# EAGLE design Prototipo v1 (EAGLE 9.7.0)
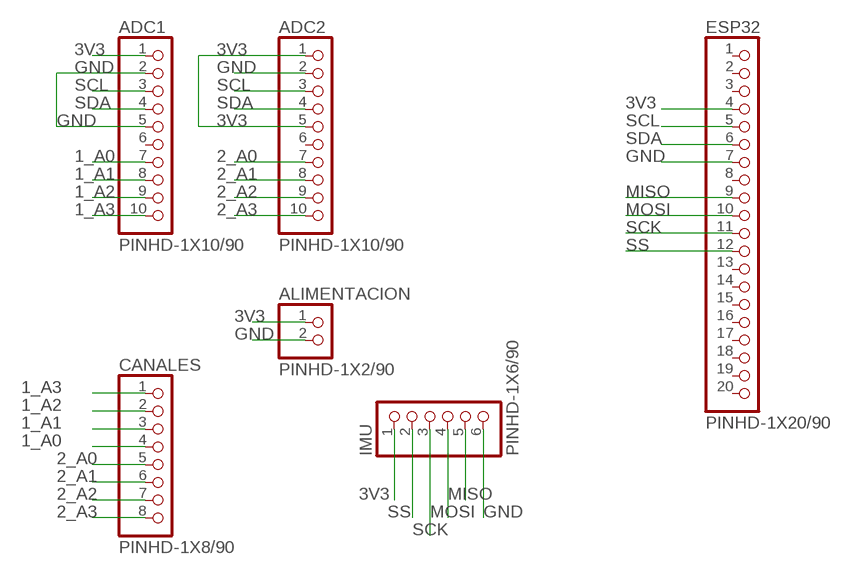
[diagram p0: schematic, sheet 1]

## Parts
ADC1  PINHD-1X10/90  [1X10/90]
ADC2  PINHD-1X10/90  [1X10/90]
ALIMENTACION  PINHD-1X2/90  [1X02/90]
CANALES  PINHD-1X8/90  [1X08/90]
ESP32  PINHD-1X20/90  [1X20/90]
IMU  PINHD-1X6/90  [1X06/90]

## Nets
1_A0: ADC1.7 CANALES.4
1_A1: ADC1.8 CANALES.3
1_A2: ADC1.9 CANALES.2
1_A3: ADC1.10 CANALES.1
2_A0: ADC2.7 CANALES.5
2_A1: ADC2.8 CANALES.6
2_A2: ADC2.9 CANALES.7
2_A3: ADC2.10 CANALES.8
3V3: ADC1.1 ADC2.1 ADC2.5 ALIMENTACION.1 ESP32.4 IMU.1
GND: ADC1.2 ADC1.5 ADC2.2 ALIMENTACION.2 ESP32.7 IMU.6
MISO: ESP32.9 IMU.5
MOSI: ESP32.10 IMU.4
SCK: ESP32.11 IMU.3
SCL: ADC1.3 ADC2.3 ESP32.5
SDA: ADC1.4 ADC2.4 ESP32.6
SS: ESP32.12 IMU.2
Unconnected: ADC1.6 ADC2.6 ESP32.1 ESP32.2 ESP32.3 ESP32.8 ESP32.13 ESP32.14 ESP32.15 ESP32.16 ESP32.17 ESP32.18 ESP32.19 ESP32.20

## Library data of the parts
ADC1 ADC2 = Connector:PINHD-1X10: PIN HEADER; CATEGORY: Headers; DESCRIPTION: Header, Right Angle, 10 Position; MANUFACTURER: Generic; MPN: Generic; OPERATING_TEMPERATURE: Generic; PART_STATUS: Active; PITCH: 0.100" (2.54mm); ROHS_COMPLIANCE: Generic; SERIES: Generic; SUB-CATEGORY: Headers, Male Pins; TYPE: Board to Board or Cable, Unshrouded, Through Hole, Right Angle
ALIMENTACION = Connector:PINHD-1X2: PIN HEADER; CATEGORY: Headers; DESCRIPTION: Header, Right Angle, 2 Position; MANUFACTURER: Generic; MPN: Generic; OPERATING_TEMPERATURE: Generic; PART_STATUS: Active; PITCH: 0.100" (2.54mm); ROHS_COMPLIANCE: Generic; SERIES: Generic; SUB-CATEGORY: Headers, Male Pins; TYPE: Board to Board or Cable, Unshrouded, Through Hole, Right Angle
CANALES = Connector:PINHD-1X8: PIN HEADER; CATEGORY: Headers; DESCRIPTION: Header, Right Angle, 8 Position; MANUFACTURER: Generic; MPN: Generic; OPERATING_TEMPERATURE: Generic; PART_STATUS: Active; PITCH: 0.100" (2.54mm); ROHS_COMPLIANCE: Generic; SERIES: Generic; SUB-CATEGORY: Headers, Male Pins; TYPE: Board to Board or Cable, Unshrouded, Through Hole, Right Angle
ESP32 = Connector:PINHD-1X20: PIN HEADER; CATEGORY: Headers; DESCRIPTION: Header, Right Angle, 20 Position; MANUFACTURER: Generic; MPN: Generic; OPERATING_TEMPERATURE: Generic; PART_STATUS: Active; PITCH: 0.100" (2.54mm); ROHS_COMPLIANCE: Generic; SERIES: Generic; SUB-CATEGORY: Headers, Male Pins; TYPE: Board to Board or Cable, Unshrouded, Through Hole, Right Angle
IMU = Connector:PINHD-1X6: PIN HEADER; CATEGORY: Headers; DESCRIPTION: Header, Right Angle, 6 Position; MANUFACTURER: Generic; MPN: Generic; OPERATING_TEMPERATURE: Generic; PART_STATUS: Active; PITCH: 0.100" (2.54mm); ROHS_COMPLIANCE: Generic; SERIES: Generic; SUB-CATEGORY: Headers, Male Pins; TYPE: Board to Board or Cable, Unshrouded, Through Hole, Right Angle

## Board
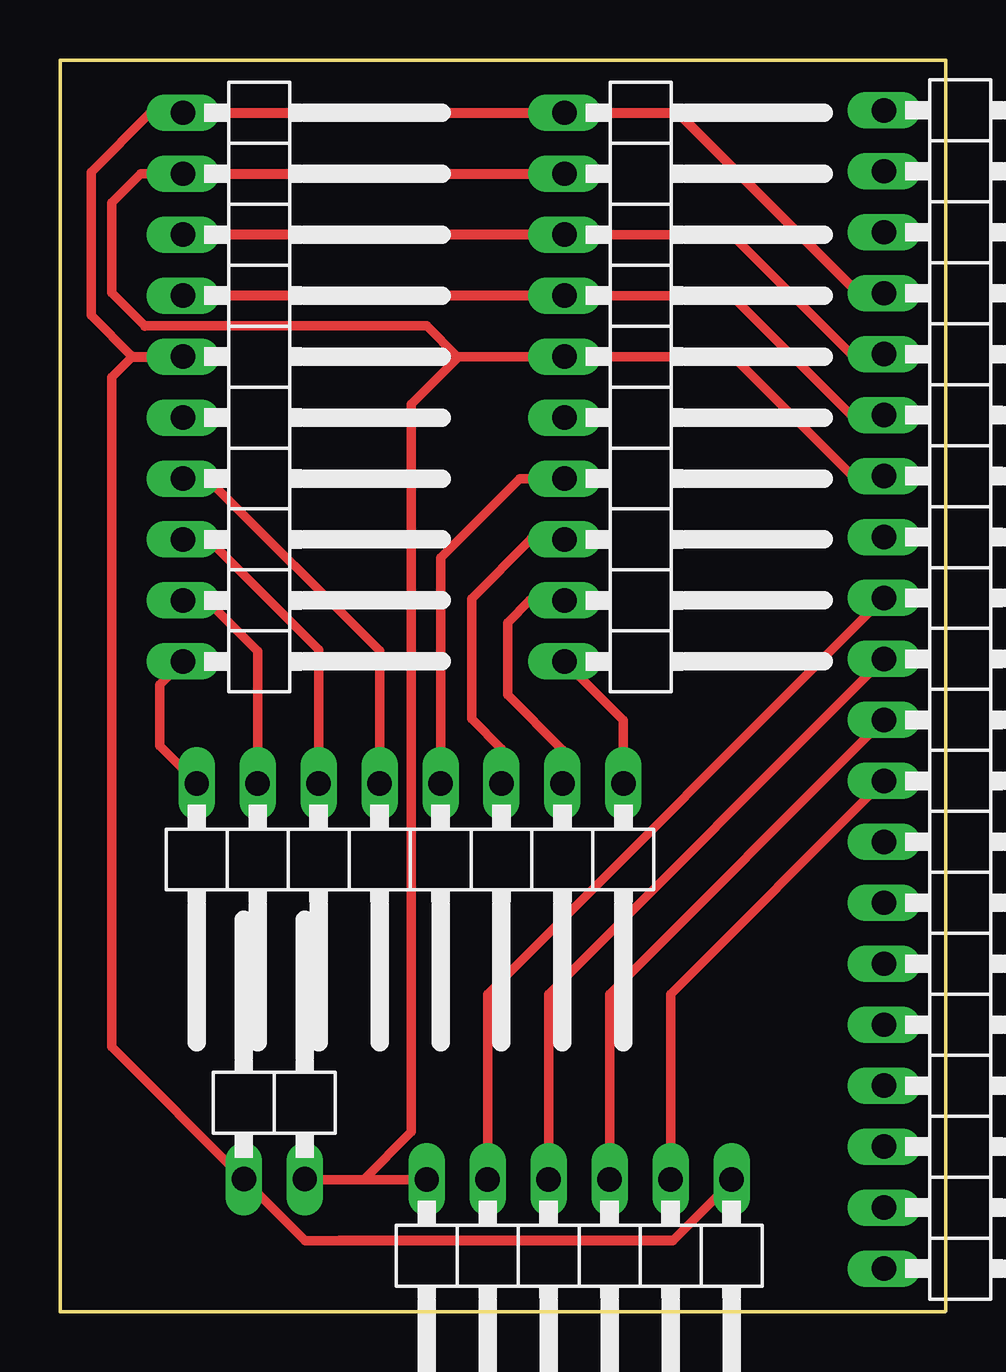
[diagram p1: board, top side]

Size 36.9 x 52.16 mm. Coordinates in mm from the lower left corner, seen from the top.
Outline: 0,52.16 0,0 36.88,0 36.9,0.02 36.9,52.16 0,52.16
Copper layers (1*16): Top / Bottom
Stack-up Default Layer Stack: Top User Defined 0.035mm / Dielectric-1 User Defined 1.5mm / Bottom User Defined 0.035mm
Design rules: minimum copper width 6mil, minimum drill size 0.35mm, copper clearance wire_polygon to wire_polygon 6mil, copper clearance wire_polygon to pad_smd 6mil, copper clearance wire_polygon to via 6mil, copper clearance pad_smd to pad_smd 6mil, copper clearance pad_smd to via 6mil, copper clearance via to via 6mil, copper clearance smd to pad (same net) 6mil, copper clearance smd to via (same net) 6mil, copper clearance smd to smd (same net) 6mil, dimension clearance 40mil, via restrict clearance 0mil, restrict clearance 0mil, drill distance 6mil, keepout clearance 0mil

### Footprints (pad centres in the part's own frame; a part is rotated, then mirrored left to right if it is on the bottom)
1X10/90 = drill 1.016 long: 1 -11.43,-3.81; 2 -8.89,-3.81; 3 -6.35,-3.81; 4 -3.81,-3.81; 5 -1.27,-3.81; 6 1.27,-3.81; 7 3.81,-3.81; 8 6.35,-3.81; 9 8.89,-3.81; 10 11.43,-3.81
1X02/90 = drill 1.016 long: 1 -1.27,-3.81; 2 1.27,-3.81
1X08/90 = drill 1.016 long: 1 -8.89,-3.81; 2 -6.35,-3.81; 3 -3.81,-3.81; 4 -1.27,-3.81; 5 1.27,-3.81; 6 3.81,-3.81; 7 6.35,-3.81; 8 8.89,-3.81
1X20/90 = drill 1.016 long: 1 -24.13,-3.81; 2 -21.59,-3.81; 3 -19.05,-3.81; 4 -16.51,-3.81; 5 -13.97,-3.81; 6 -11.43,-3.81; 7 -8.89,-3.81; 8 -6.35,-3.81; 9 -3.81,-3.81; 10 -1.27,-3.81; 11 1.27,-3.81; 12 3.81,-3.81; 13 6.35,-3.81; 14 8.89,-3.81; 15 11.43,-3.81; 16 13.97,-3.81; 17 16.51,-3.81; 18 19.05,-3.81; 19 21.59,-3.81; 20 24.13,-3.81
1X06/90 = drill 1.016 long: 1 -6.35,-3.81; 2 -3.81,-3.81; 3 -1.27,-3.81; 4 1.27,-3.81; 5 3.81,-3.81; 6 6.35,-3.81

### Placement (x,y rotation side)
ADC1  24.83,38.53 270 top
ADC2  8.93,38.53 270 top
ALIMENTACION  8.93,9.34 0 top
CANALES  14.59,18.21 180 top
ESP32  38.14,25.93 270 top
IMU  21.63,1.7 180 top

### Tracks (layer width: path | path; a pad name or v marks a point on that pad's centre or on a via)
1_A0
  Top 0.4: CANALES.4 15.86,31.42 19.16,34.72 ADC1.7
1_A1
  Top 0.4: CANALES.3 18.4,23.46 17.15,24.71 17.15,29.71 19.62,32.18 ADC1.8
1_A2
  Top 0.4: CANALES.2 20.94,23.42 18.65,25.71 18.65,28.71 19.58,29.64 ADC1.9
1_A3
  Top 0.4: CANALES.1 23.48,24.65 ADC1.10
2_A0
  Top 0.4: CANALES.5 13.32,27.54 6.14,34.72 ADC2.7
2_A1
  Top 0.4: CANALES.6 10.78,27.58 6.18,32.18 ADC2.8
2_A2
  Top 0.4: CANALES.7 8.24,27.52 6.12,29.64 ADC2.9
2_A3
  Top 0.4: CANALES.8 5.7,22.04 4.15,23.59 4.15,26.13 ADC2.10
3V3
  Top 0.4: IMU.1 27.98,5.43 25.53,2.97 | 11.65,2.97 10.22,2.97 ALIMENTACION.1 2.15,11.04 2.15,38.93 3.02,39.8 1.29,41.52 1.29,47.49 3.77,49.96
  Top 0.406: 3.77,49.96 ADC2.1 ADC1.1 25.74,49.96 33.26,42.44 ESP32.4 | 3.02,39.8 ADC2.5 | 25.53,2.97 11.65,2.97
GND
  Top 0.4: 14.65,24.1 14.64,24.1 | ADC2.2 3.36,47.42 2.15,46.21 2.15,42.46 3.52,41.08 | 3.54,41.07 3.52,41.08 | ESP32.7 33.04,34.82 28.06,39.8 ADC1.5 | ADC1.5 20.29,39.8 | ADC1.5 16.62,39.8 | 16.62,39.8 14.64,37.82 14.64,24.1 | IMU.6 12.65,5.51 | 12.65,5.51 10.22,5.51 ALIMENTACION.2 | 14.64,24.1 14.64,7.5 12.65,5.51 | 16.62,39.8 16.56,39.8 15.28,41.08 3.52,41.08
  Top 0.406: ADC2.2 ADC1.2
MISO
  Top 0.4: IMU.5 17.82,13.23 ESP32.9
  Top 0.406: ESP32.9 34.23,29.64
MOSI
  Top 0.4: IMU.4 20.36,13.23 ESP32.10
SCK
  Top 0.4: IMU.3 22.9,13.23 ESP32.11
SCL
  Top 0.4: ESP32.5 32.96,39.9 27.98,44.88 ADC1.3
  Top 0.406: ADC1.3 ADC2.3
SDA
  Top 0.4: ESP32.6 32.96,37.36 27.98,42.34 ADC1.4
  Top 0.406: ADC1.4 ADC2.4 | 34.23,37.26 ESP32.6
SS
  Top 0.4: IMU.2 25.44,13.23 ESP32.12